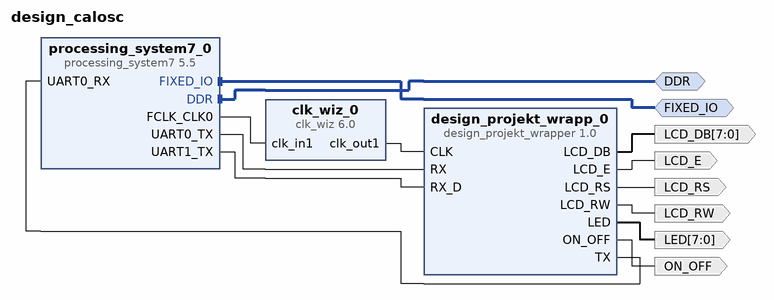
[diagram p0: block diagram of the top level]
# Vivado block design design_calosc, xc7z020clg400-2, Vivado 2019.1
create_bd_design design_calosc

create_bd_intf_port -mode Master -vlnv xilinx.com:interface:ddrx_rtl:1.0 DDR
create_bd_intf_port -mode Master -vlnv xilinx.com:display_processing_system7:fixedio_rtl:1.0 FIXED_IO
create_bd_port -dir O -from 7 -to 0 LCD_DB
create_bd_port -dir O LCD_E
create_bd_port -dir O LCD_RS
create_bd_port -dir O LCD_RW
create_bd_port -dir O -from 7 -to 0 LED
create_bd_port -dir O ON_OFF

create_bd_cell -type ip -vlnv xilinx.com:user:design_projekt_wrapper:1.0 design_projekt_wrapp_0
create_bd_cell -type ip -vlnv xilinx.com:ip:clk_wiz:6.0 clk_wiz_0
set_property -dict {CONFIG.USE_LOCKED false CONFIG.USE_RESET false} [get_bd_cells clk_wiz_0]
create_bd_cell -type ip -vlnv xilinx.com:ip:processing_system7:5.5 processing_system7_0
set_property -dict [list \
  CONFIG.PCW_I2C_PERIPHERAL_FREQMHZ 111.111115 \
  CONFIG.PCW_UART0_PERIPHERAL_ENABLE 1 \
  CONFIG.PCW_UART0_UART0_IO EMIO \
  CONFIG.PCW_UART1_PERIPHERAL_ENABLE 1 \
  CONFIG.PCW_UART1_UART1_IO EMIO \
  CONFIG.PCW_UART_PERIPHERAL_FREQMHZ 100 \
  CONFIG.PCW_USE_M_AXI_GP0 0 \
] [get_bd_cells processing_system7_0]
# 52 more settings of processing_system7_0 are not shown: defaults, MIO pin electricals, DDR timing, and values the tool derives

# ---- connections ----

connect_bd_intf_net [get_bd_intf_ports FIXED_IO] [get_bd_intf_pins processing_system7_0/FIXED_IO]
connect_bd_intf_net [get_bd_intf_ports DDR] [get_bd_intf_pins processing_system7_0/DDR]
connect_bd_net [get_bd_pins design_projekt_wrapp_0/LCD_DB] [get_bd_ports LCD_DB]
connect_bd_net [get_bd_pins design_projekt_wrapp_0/LCD_E] [get_bd_ports LCD_E]
connect_bd_net [get_bd_pins design_projekt_wrapp_0/LCD_RS] [get_bd_ports LCD_RS]
connect_bd_net [get_bd_pins design_projekt_wrapp_0/LCD_RW] [get_bd_ports LCD_RW]
connect_bd_net [get_bd_pins design_projekt_wrapp_0/LED] [get_bd_ports LED]
connect_bd_net [get_bd_pins design_projekt_wrapp_0/ON_OFF] [get_bd_ports ON_OFF]
connect_bd_net [get_bd_pins clk_wiz_0/clk_out1] [get_bd_pins design_projekt_wrapp_0/CLK]
connect_bd_net [get_bd_pins processing_system7_0/FCLK_CLK0] [get_bd_pins clk_wiz_0/clk_in1]
connect_bd_net [get_bd_pins processing_system7_0/UART0_TX] [get_bd_pins design_projekt_wrapp_0/RX]
connect_bd_net [get_bd_pins design_projekt_wrapp_0/TX] [get_bd_pins processing_system7_0/UART0_RX]
connect_bd_net [get_bd_pins processing_system7_0/UART1_TX] [get_bd_pins design_projekt_wrapp_0/RX_D]

validate_bd_design
save_bd_design
